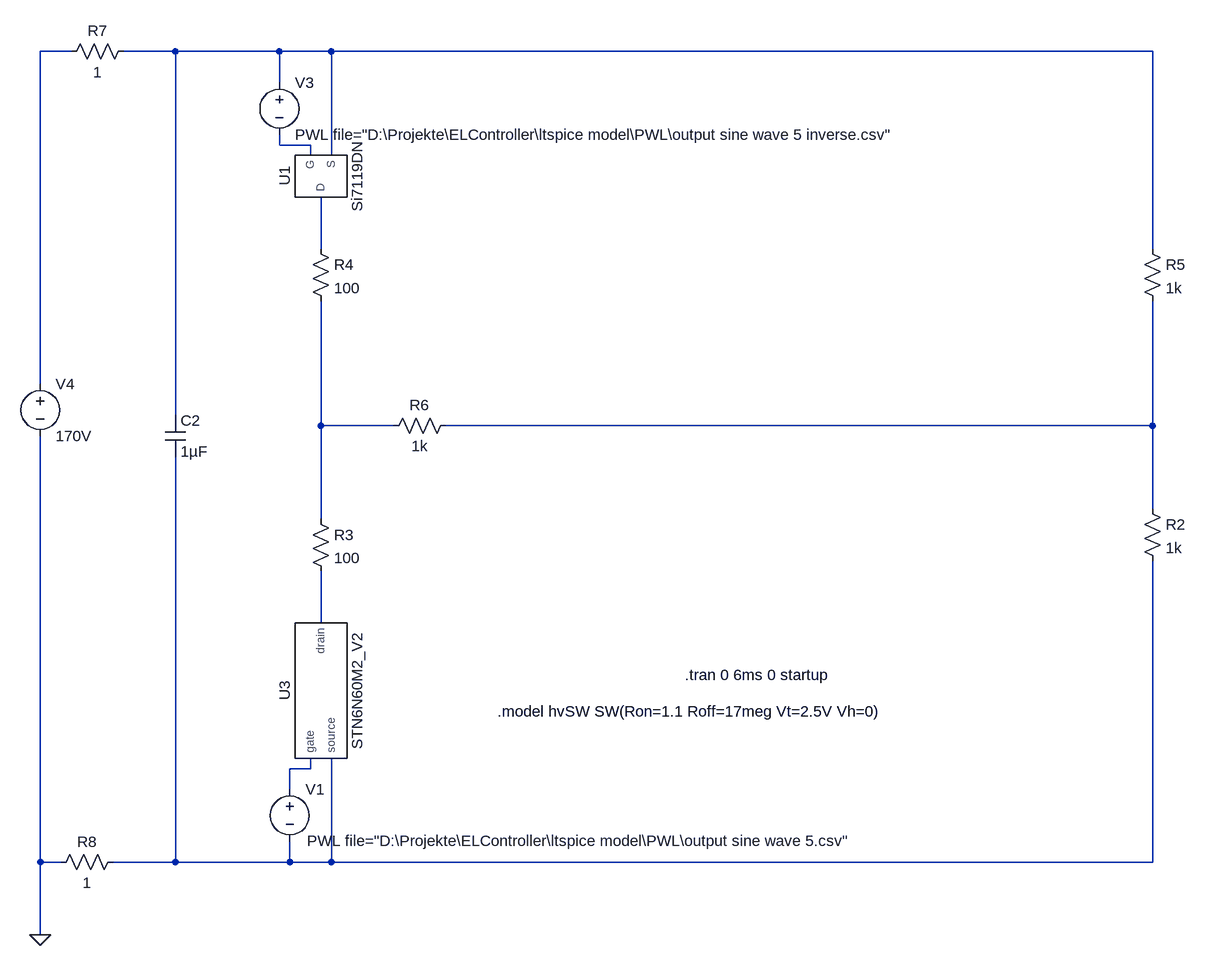
[diagram p0: schematic Filter Test T50.asc]
Filter Test T50.asc, the LTspice schematic file:
Version 4
SHEET 1 2672 884
WIRE -752 -496 -800 -496
WIRE -592 -496 -672 -496
WIRE -432 -496 -592 -496
WIRE -352 -496 -432 -496
WIRE 912 -496 -352 -496
WIRE -432 -448 -432 -496
WIRE -432 -352 -432 -368
WIRE -384 -352 -432 -352
WIRE -384 -336 -384 -352
WIRE -352 -336 -352 -496
WIRE -368 -192 -368 -272
WIRE 912 -192 912 -496
WIRE -800 16 -800 -496
WIRE -592 64 -592 -496
WIRE -368 80 -368 -112
WIRE -256 80 -368 80
WIRE 912 80 912 -112
WIRE 912 80 -176 80
WIRE 912 208 912 80
WIRE -368 224 -368 80
WIRE -368 384 -368 304
WIRE -384 608 -384 592
WIRE -384 608 -416 608
WIRE -416 640 -416 608
WIRE -800 752 -800 96
WIRE -768 752 -800 752
WIRE -592 752 -592 128
WIRE -592 752 -688 752
WIRE -416 752 -416 720
WIRE -416 752 -592 752
WIRE -352 752 -352 592
WIRE -352 752 -416 752
WIRE 912 752 912 288
WIRE 912 752 -352 752
WIRE -800 864 -800 752
FLAG -800 864 0
SYMBOL voltage -416 624 R0
WINDOW 123 0 0 Left 0
WINDOW 39 0 0 Left 0
WINDOW 3 27 95 Left 2
SYMATTR Value PWL file="D:\Projekte\ELController\ltspice model\PWL\output sine wave 5.csv"
SYMATTR InstName V1
SYMBOL res -160 64 R90
WINDOW 0 0 56 VBottom 2
WINDOW 3 32 56 VTop 2
SYMATTR InstName R6
SYMATTR Value 1k
SYMBOL cap -608 64 R0
SYMATTR InstName C2
SYMATTR Value 1µF
SYMBOL res -656 -512 R90
WINDOW 0 0 56 VBottom 2
WINDOW 3 32 56 VTop 2
SYMATTR InstName R7
SYMATTR Value 1
SYMBOL res -672 736 R90
WINDOW 0 0 56 VBottom 2
WINDOW 3 32 56 VTop 2
SYMATTR InstName R8
SYMATTR Value 1
SYMBOL voltage -800 0 R0
WINDOW 123 0 0 Left 0
WINDOW 39 0 0 Left 0
SYMATTR InstName V4
SYMATTR Value 170V
SYMBOL AutoGenerated\\Si7119DN -368 -304 R270
SYMATTR InstName U1
SYMBOL AutoGenerated\\STN6N60M2_V2 -368 480 M90
SYMATTR InstName U3
SYMBOL voltage -432 -464 R0
WINDOW 123 0 0 Left 0
WINDOW 39 0 0 Left 0
SYMATTR InstName V3
SYMATTR Value PWL file="D:\Projekte\ELController\ltspice model\PWL\output sine wave 5 inverse.csv"
SYMBOL res 896 192 R0
SYMATTR InstName R2
SYMATTR Value 1k
SYMBOL res -384 208 R0
SYMATTR InstName R3
SYMATTR Value 100
SYMBOL res -384 -208 R0
SYMATTR InstName R4
SYMATTR Value 100
SYMBOL res 896 -208 R0
SYMATTR InstName R5
SYMATTR Value 1k
TEXT 192 464 Left 2 !.tran 0 6ms 0 startup
TEXT -96 520 Left 2 !.model hvSW SW(Ron=1.1 Roff=17meg Vt=2.5V Vh=0)

The netlist it stands for:
* Filter Test T50.asc
V1 N008 N009 PWL file="D:\Projekte\ELController\ltspice model\PWL\output sine wave 5.csv"
R6 N006 N005 1k
C2 N002 N009 1µF
R7 N002 N001 1
R8 N009 0 1
V4 N001 0 170V
XU1 N004 N003 N002 Si7119DN  ; pins D G S
XU3 N007 N008 N009 STN6N60M2_V2  ; pins drain gate source
V3 N002 N003 PWL file="D:\Projekte\ELController\ltspice model\PWL\output sine wave 5 inverse.csv"
R2 N006 N009 1k
R3 N005 N007 100
R4 N004 N005 100
R5 N002 N006 1k
.tran 0 6ms 0 startup
.model hvSW SW(Ron=1.1 Roff=17meg Vt=2.5V Vh=0)
.lib Z:\media\Daten\Projekte\ELController\ltspice model\si7119dn\si7119dn_ps.lib
.lib D:\Projekte\ELController\ltspice model\en.stn6n60m2_spice\STN6N60M2_V2.LIB
.backanno
.end